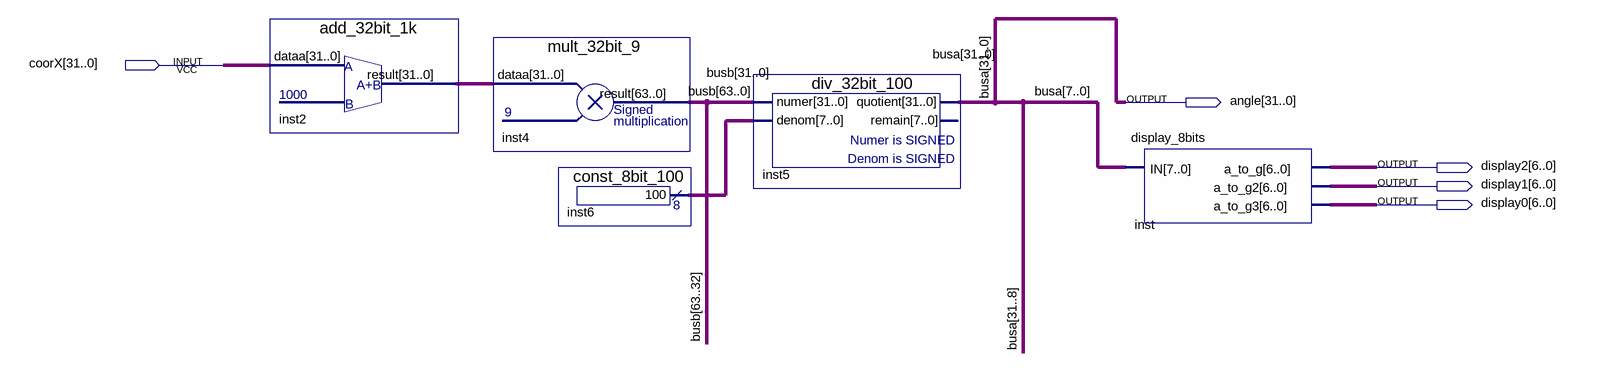
[diagram p0: schematic sheet]
// Quartus schematic angle_calculator.bdf as structural Verilog: 5 symbols, 5 pins
module angle_calculator (
  input  [31:0] coorX,
  output [31:0] angle,
  output [6:0] display2,
  output [6:0] display1,
  output [6:0] display0
);

  wire [7:0] inst6_result;
  wire [31:0] inst2_result;
  wire [63:0] busb;

  add_32bit_1k inst2 (.dataa(coorX), .result(inst2_result));
  mult_32bit_9 inst4 (.dataa(inst2_result), .result(busb));
  const_8bit_100 inst6 (.result(inst6_result));
  div_32bit_100 inst5 (.numer(busb[31:0]), .denom(inst6_result), .quotient(angle));  // open: remain
  display_8bits inst (.IN(angle[7:0]), .a_to_g(display2), .a_to_g2(display1), .a_to_g3(display0));

  // Other names for the same wires on the sheet: busa[31:0] = angle
endmodule
